# Altium schematic sheet 52_Alimentacion.SchDoc
size A4; SheetNumber: 13; SheetTotal: 20
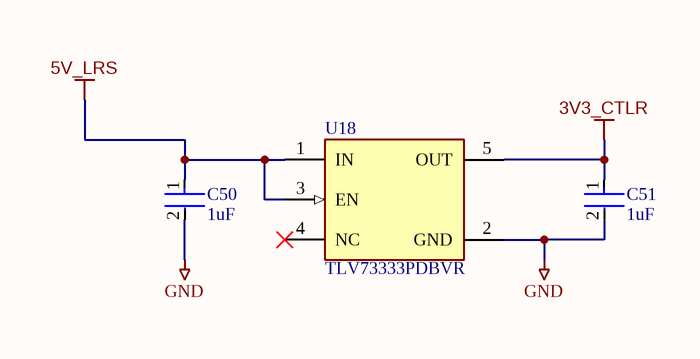
[diagram p0: 52_Alimentacion.SchDoc]

## Parts
C50  1uF  [FP-C0402C-BB-IPC_B]
C51  1uF  [FP-C0402C-BB-IPC_B]
U18  TLV73333PDBVR  [FP-DBV0005A-MFG]

## Nets
3V3_CTLR: C51.1 U18.5(OUT)
5V_LRS: C50.1 U18.1(IN) U18.3(EN)
GND: C50.2 C51.2 U18.2(GND)

Not connected (* = marked no-connect by the designer): U18 4(NC)*

## Library data of the parts
C50 C51 = CMP-03020-034679-1: CAP CER 1UF 16V X5R 0402; Dielectric Material: Ceramic; Tolerance: 10%; RoHS Compliant: Yes; Voltage Rating (DC): 16V; Voltage Rating: 16V; Max Operating Temperature: 85°C; Packaging: Cut Tape; Width: 0.02inch; Dielectric: X5R; Lead Free: Lead Free; Min Operating Temperature: -55°C; Mount: Surface Mount; Case/Package: 0402; Thickness: 0.022inch; REACH SVHC: No SVHC; Length: 0.039inch; Case Code (Metric): 1005; Case Code (Imperial): 0402; Capacitance: 1uF
U18 = CMP-04917-000053-1: IC REG LINEAR 3.3V 300MA SOT23-5; Manufacturer: Texas Instruments; Max Junction Temp: +125°C; Accuracy Percentage: 1%; Min Supply Voltage: 1.4V; Number Of Outputs: 1; Dropout Voltage: 125mV; Nominal Supply Current: 34uA; Max Supply Voltage: 5.5V; Output Type: Fixed; Standoff Height: 0mm; Digikey Description: IC REG LINEAR 3.3V 300MA SOT23-5; Manufacturer Part Number: TLV73333PDBVR; Temperature Range High: +125°C; Temperature: -40°C to +125°C; Output Current: 300mA; Mouser Description: LDO Voltage Regulators Capacitr-Free 300-mA 5-SOT-23 -40 to 125; Automotive: No; Height: 1.45mm; Device Class L3: Voltage Regulators - Linear; ComponentLink2Description: Datasheet; Device Class L1: Integrated Circuits (ICs); ComponentLink2URL: http://www.ti.com/lit/ds/symlink/tlv733p.pdf; Octopart: https://octopart.com/tlv73333pdbvr-texas+instruments-51080890; Temperature Range Low: -40°C; RoHS: TRUE; Lead Free: Yes; Output Voltage: 3.3V; Package: DBV0005A; Device Class L2: Power Management ICs; Category: IC